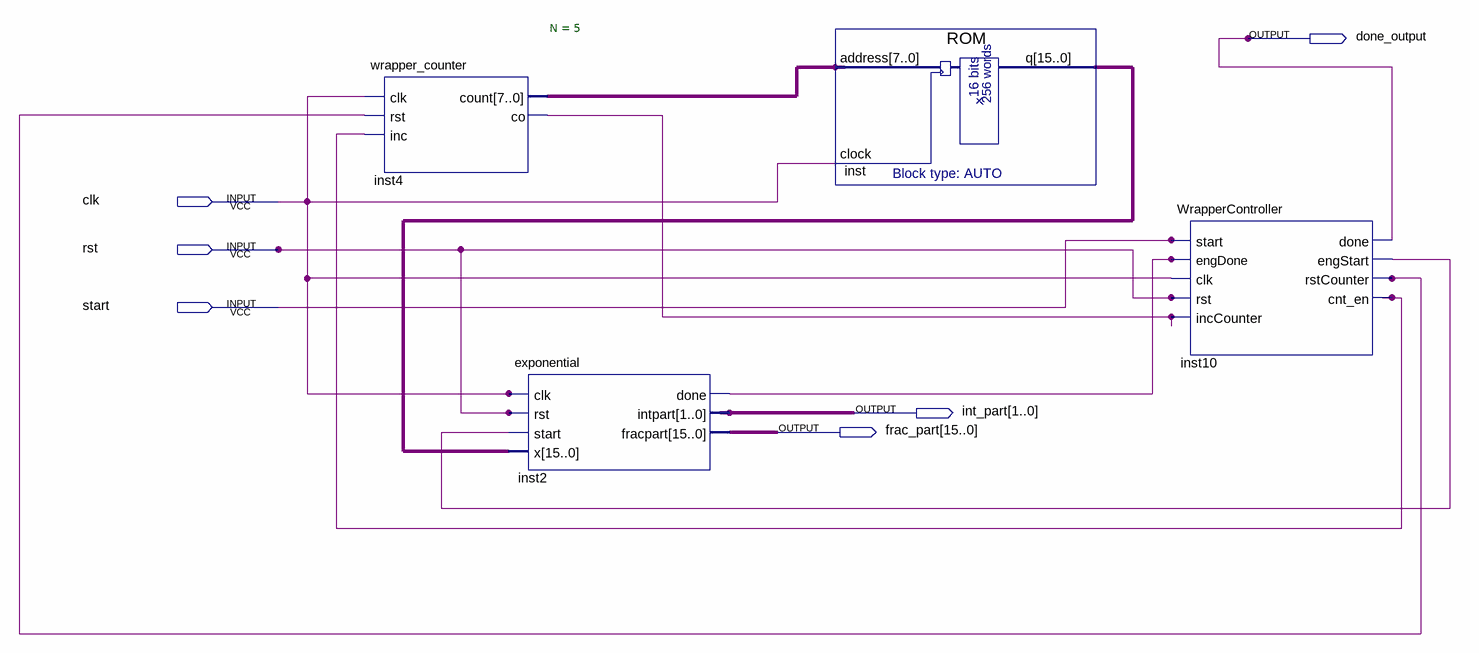
[diagram p0: schematic sheet]
// Quartus schematic DLD_LAB4_Quartus.bdf as structural Verilog: 4 symbols, 6 pins
module DLD_LAB4_Quartus (
  input  clk,
  input  rst,
  input  start,
  output done_output,
  output [1:0] int_part,
  output [15:0] frac_part
);

  wire inst2_done, inst4_co, inst10_cnt_en, inst10_engstart, inst10_rstcounter;
  wire [7:0] inst4_count;
  wire [15:0] inst_q;

  wrapper_counter #(.N(5)) inst4 (
    .clk(clk), .rst(inst10_rstcounter), .inc(inst10_cnt_en), .count(inst4_count), .co(inst4_co));
  exponential inst2 (
    .clk(clk), .rst(rst), .start(inst10_engstart), .x(inst_q), .done(inst2_done), .intpart(int_part),
    .fracpart(frac_part));
  ROM inst (.address(inst4_count), .clock(clk), .q(inst_q));
  WrapperController inst10 (
    .start(start), .engDone(inst2_done), .clk(clk), .rst(rst), .incCounter(inst4_co), .done(done_output),
    .engStart(inst10_engstart), .rstCounter(inst10_rstcounter), .cnt_en(inst10_cnt_en));
endmodule
